# Altium schematic sheet MKXdbV2_ADC0.SchDoc
size A
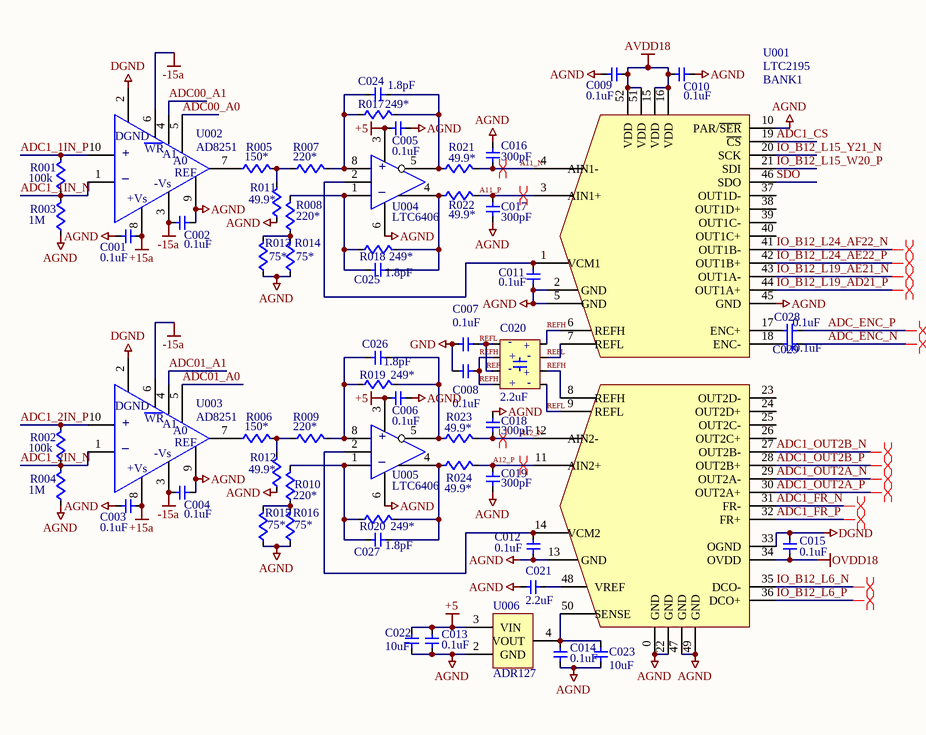
[diagram p0: MKXdbV2_ADC0.SchDoc]

## Parts
C001  0.1uF  [0603w]
C002  0.1uF  [0603w]
C003  0.1uF  [0603w]
C004  0.1uF  [0603w]
C005  0.1uF  [0603w]
C006  0.1uF  [0603w]
C007  0.1uF  [0603w]
C008  0.1uF  [0603w]
C009  0.1uF  [0603w]
C010  0.1uF  [0603w]
C011  0.1uF  [0603w]
C012  0.1uF  [0603w]
C013  0.1uF  [0603w]
C014  0.1uF  [0603w]
C015  0.1uF  [0603w]
C016  300pF  [0603w]
C017  300pF  [0603w]
C018  300pF  [0603w]
C019  300pF  [0603w]
C020  2.2uF  [1206CLL]
C021  2.2uF  [0603w]
C022  10uF  [0603w]
C023  10uF  [0603w]
C024  1.8pF  [0603w]
C025  1.8pF  [0603w]
C026  1.8pF  [0603w]
C027  1.8pF  [0603w]
C028  0.1uF  [1206]
C029  0.1uF  [1206]
R001  100k  [0603w]
R002  100k  [0603w]
R003  1M  [0603w]
R004  1M  [0603w]
R005  150*  [0603w]
R006  150*  [0603w]
R007  220*  [0603w]
R008  220*  [0603w]
R009  220*  [0603w]
R010  220*  [0603w]
R011  49.9*  [0603w]
R012  49.9*  [0603w]
R013  75*  [0603w]
R014  75*  [0603w]
R015  75*  [0603w]
R016  75*  [0603w]
R017  249*  [0603w]
R018  249*  [0603w]
R019  249*  [0603w]
R020  249*  [0603w]
R021  49.9*  [0603w]
R022  49.9*  [0603w]
R023  49.9*  [0603w]
R024  49.9*  [0603w]
U001  LTC2195  [UKG - QFN52]
U002  AD8251  [MSOP10sm]
U003  AD8251  [MSOP10sm]
U004  LTC6406  [MSOP08]
U005  LTC6406  [MSOP08]
U006  ADR127  [TSOT-6]

## Nets
+5: C005.1 C006.1 C013.2 C022.1 U004.3 U005.3 U006.3(VIN)
+15a: C001.1 C003.1 U002.8 U003.8
-15a: C002.1 C004.1 U002.3 U002.6 U003.3 U003.6
AGND: C001.2 C002.2 C003.2 C004.2 C005.2 C006.2 C009.2 C010.2 C011.2 C012.2 C013.1 C014.1 C016.1 C017.2 C018.1 C019.2 C021.2 C022.2 C023.2 R003.1 R004.1 R011.1 R012.1 R013.1 R014.1 R015.1 R016.1 U001.0(GND) U001.2(GND) U001.5(GND) U001.10(PAR/~{SER}) U001.13(GND) U001.22(GND) U001.45(GND) U001.47(GND) U001.49(GND) U002.9 U003.9 U004.6 U005.6 U006.2(GND)
AVDD18: C009.1 C010.1 U001.15(VDD) U001.16(VDD) U001.51(VDD) U001.52(VDD)
DGND: C015.1 U001.33(OGND) U002.2 U003.2
GND: C007.2 C008.2
OVDD18: C015.2 U001.34(OVDD)
A11_N: C016.2 R021.2 U001.4(AIN1-)
A11_P: C017.1 R022.2 U001.3(AIN1+)
A12_N: C018.2 R023.2 U001.12(AIN2-)
A12_P: C019.1 R024.2 U001.11(AIN2+)
ADC00_A0: U002.5
ADC00_A1: U002.4
ADC1_1IN_N: R001.1 R003.2 U002.1
ADC1_1IN_P: R001.2 U002.10
ADC1_2IN_N: R002.1 R004.2 U003.1
ADC1_2IN_P: R002.2 U003.10
ADC01_A0: U003.5
ADC01_A1: U003.4
ADC1_CS: U001.19(~{CS})
ADC1_FR_N: U001.31(FR-)
ADC1_FR_P: U001.32(FR+)
ADC1_OUT2A_N: U001.29(OUT2A-)
ADC1_OUT2A_P: U001.30(OUT2A+)
ADC1_OUT2B_N: U001.27(OUT2B-)
ADC1_OUT2B_P: U001.28(OUT2B+)
ADC_ENC_N: C029.2
ADC_ENC_P: C028.2
IO_B12_L6_N: U001.35(DCO-)
IO_B12_L6_P: U001.36(DCO+)
IO_B12_L15_W20_P: U001.21(SDI)
IO_B12_L15_Y21_N: U001.20(SCK)
IO_B12_L19_AD21_P: U001.44(OUT1A+)
IO_B12_L19_AE21_N: U001.43(OUT1A-)
IO_B12_L24_AE22_P: U001.42(OUT1B+)
IO_B12_L24_AF22_N: U001.41(OUT1B-)
REFH: C008.1 C020.2 C020.4 C020.6 C020.8 U001.6(REFH) U001.8(REFH)
REFL: C007.1 C020.1 C020.3 C020.5 C020.7 U001.7(REFL) U001.9(REFL)
SDO: U001.46(SDO)
NetC011_1: C011.1 U001.1(VCM1) U004.2
NetC012_1: C012.1 U001.14(VCM2) U005.2
NetC014_2: C014.2 C023.1 U001.50(SENSE) U006.4(VOUT)
NetC021_1: C021.1 U001.48(VREF)
NetC024_1: C024.1 R007.2 R017.1 U004.8
NetC024_2: C024.2 R017.2 R021.1 U004.5
NetC025_1: C025.1 R008.2 R018.1 U004.1
NetC025_2: C025.2 R018.2 R022.1 U004.4
NetC026_1: C026.1 R009.2 R019.1 U005.8
NetC026_2: C026.2 R019.2 R023.1 U005.5
NetC027_1: C027.1 R010.2 R020.1 U005.1
NetC027_2: C027.2 R020.2 R024.1 U005.4
NetC028_1: C028.1 U001.17(ENC+)
NetC029_1: C029.1 U001.18(ENC-)
NetR005_1: R005.1 U002.7
NetR005_2: R005.2 R007.1 R011.2
NetR006_1: R006.1 U003.7
NetR006_2: R006.2 R009.1 R012.2
NetR008_1: R008.1 R013.2 R014.2
NetR010_1: R010.1 R015.2 R016.2

Not connected (* = marked no-connect by the designer): U001 23(OUT2D-) 24(OUT2D+) 25(OUT2C-) 26(OUT2C+) 37(OUT1D-) 38(OUT1D+) 39(OUT1C-) 40(OUT1C+); U006 1(NC) 5(NC) 6(NC)

## Layout directives
differential pair: A11_N, A11_P, A12_N, A12_P, ADC1_FR_N, ADC1_FR_P, ADC1_OUT2A_N, ADC1_OUT2A_P, ADC1_OUT2B_N, ADC1_OUT2B_P, ADC_ENC_N, ADC_ENC_P, IO_B12_L6_N, IO_B12_L6_P, IO_B12_L19_AD21_P, IO_B12_L19_AE21_N, IO_B12_L24_AE22_P, IO_B12_L24_AF22_N

## Notes on the sheet
- (near U001) BANK1
- (in symbol AD8139) +; _
- (in symbol AD8251) DGND; WR; +; A1; A0; _; REF; -Vs; +Vs
- (in symbol CAP_SM Interdigitated) +

## Library data of the parts
C001 C002 C003 C004 C006 C007 C008 C009 C010 C011 C012 C013 C014 C015 = CAP_SM_1: capacitor; Manufacturer: Kemet; Manufacturer Part Number: C0603C104K3RACTU; Capacitance: 0.1µF; Temperature Coefficient: X7R; Tolerance: ±10%; Voltage - Rated: 25V; Applications: General Purpose; Category: Capacitors; ComponentLink1Description: http://www.kemet.com/datasheets&C0603C104K3RACTU; ComponentLink1URL: http://www.kemet.com/datasheets&C0603C104K3RACTU; Features: -; Lead Spacing: -; Lead Style: -; Mounting Type: Surface Mount, MLCC; Operating Temperature: -55°C ~ 125°C; Package / Case: 0603 (1608 Metric); Packaging: Cut Tape (CT); Pricing 1: 10=0.075, 100=0.027, 250=0.01952, 500=0.0144, 1000=0.00975 (USD); Ratings: -; RoHS: RoHS Compliant; Size / Dimension: 0.063" L x 0.031" W (1.60mm x 0.80mm); Stock 1: 1185883; Supplier 1: Digi-Key; Supplier Part Number 1: 399-1281-1-ND; Thickness: 0.034" (0.87mm)
C005 = CAP_SM_1: capacitor; Manufacturer: Kemet; Manufacturer Part Number: C0603C104K3RACTU; Capacitance: 0.1µF; Voltage - Rated: 25V; Tolerance: ±10%; Temperature Coefficient: X7R; Supplier 1: Digi-Key; Supplier Part Number 1: 399-1281-1-ND; RoHS: RoHS Compliant; Category: Capacitors; Stock 1: 1185883; Pricing 1: 10=0.075, 100=0.027, 250=0.01952, 500=0.0144, 1000=0.00975 (USD); Mounting Type: Surface Mount, MLCC; Operating Temperature: -55°C ~ 125°C; Applications: General Purpose; Ratings: -; Package / Case: 0603 (1608 Metric); Size / Dimension: 0.063" L x 0.031" W (1.60mm x 0.80mm); Height: -; Thickness: 0.034" (0.87mm); Lead Spacing: -; Features: -; Packaging: Cut Tape (CT); Lead Style: -; ComponentLink1URL: http://www.kemet.com/datasheets&C0603C104K3RACTU; ComponentLink1Description: http://www.kemet.com/datasheets&C0603C104K3RACTU
C016 C017 C018 C019 C024 C025 C026 C027 = CAP_SM_1: capacitor; Supplier 1: Digi-Key
  C016 C017 C018 C019: Supplier Part Number 1: 490-1438-1-ND
  C024 C025 C026 C027: Supplier Part Number 1: 712-1328-1-ND
C020 = CAP_SM Interdigitated: INTERDIGITATED capacitor; Manufacturer: TDK Corporation; Manufacturer Part Number: CLLE1AX7S0G225M/0.95; Capacitance: 2.2µF; Voltage - Rated: 4V; Tolerance: ±20%; Temperature Coefficient: X7S; Supplier 1: Digi-Key; Supplier Part Number 1: 445-3406-1-ND; RoHS: RoHS Compliant; Category: Capacitors; Stock 1: 11249; Pricing 1: 1=0.68, 10=0.54, 100=0.325, 250=0.24376, 500=0.208, 1000=0.1625 (USD); Mounting Type: Surface Mount, MLCC; Operating Temperature: -55°C ~ 125°C; Applications: General Purpose; Ratings: -; Package / Case: 0805 (2012 Metric); Size / Dimension: 0.079" L x 0.049" W (2.00mm x 1.25mm); Height: -; Thickness: 0.037" (0.95mm); Lead Spacing: -; Features: Low ESL (Multi-Terminal); Packaging: Cut Tape (CT); Lead Style: -; ComponentLink1URL: http://www.tdk.com/pdf/uli_A11.pdf; ComponentLink1Description: http://www.tdk.com/pdf/uli_A11.pdf
C021 = CAP_SM_1: capacitor; Manufacturer: AVX Corporation; Manufacturer Part Number: 06036C225KAT2A; Capacitance: 2.2µF; Voltage - Rated: 6.3V; Tolerance: ±10%; Temperature Coefficient: X7R; Supplier 1: Digi-Key; Supplier Part Number 1: 478-5316-1-ND; RoHS: RoHS Compliant; Category: Capacitors; Stock 1: 284343; Pricing 1: 10=0.209, 100=0.1235, 500=0.07126, 1000=0.0494 (USD); Mounting Type: Surface Mount, MLCC; Operating Temperature: -55°C ~ 125°C; Applications: General Purpose; Ratings: -; Package / Case: 0603 (1608 Metric); Size / Dimension: 0.063" L x 0.032" W (1.60mm x 0.81mm); Height: -; Thickness: 0.035" (0.90mm); Lead Spacing: -; Features: -; Packaging: Cut Tape (CT); Lead Style: -; ComponentLink1URL: http://www.avx.com/docs/Catalogs/cx7r.pdf; ComponentLink1Description: http://www.avx.com/docs/Catalogs/cx7r.pdf
C022 C023 = CAP_SM_1: capacitor; Manufacturer: Murata Electronics North America; Manufacturer Part Number: GRM188R60J106ME47D; Capacitance: 10µF; Voltage - Rated: 6.3V; Tolerance: ±20%; Temperature Coefficient: X5R; Supplier 1: Digi-Key; Supplier Part Number 1: 490-3896-1-ND; RoHS: RoHS Compliant; Category: Capacitors; Stock 1: 1274844; Pricing 1: 1=0.47, 10=0.369, 50=0.2428, 100=0.1926, 250=0.14236, 500=0.11056, 1000=0.0871 (USD); Mounting Type: Surface Mount, MLCC; Operating Temperature: -55°C ~ 85°C; Applications: General Purpose; Ratings: -; Package / Case: 0603 (1608 Metric); Size / Dimension: 0.063" L x 0.031" W (1.60mm x 0.80mm); Height: -; Thickness: 0.035" (0.90mm); Lead Spacing: -; Features: -; Packaging: Cut Tape (CT); Lead Style: -; ComponentLink1URL: http://search.murata.co.jp/Ceramy/image/img/PDF/ENG/GRM188R60J106ME47.pdf; ComponentLink1Description: http://search.murata.co.jp/Ceramy/image/img/PDF/ENG/GRM188R60J106ME47.pdf
C028 C029 = CAP_SM_1: capacitor; Manufacturer: Murata Electronics North America; Manufacturer Part Number: GRM31C5C1E104JA01L; Capacitance: 0.1µF; Voltage - Rated: 25V; Tolerance: ±5%; Temperature Coefficient: C0G, NP0; Supplier 1: Digi-Key; Supplier Part Number 1: 490-1767-1-ND; RoHS: RoHS Compliant; Category: Capacitors; Stock 1: 374793; Pricing 1: 1=0.57, 10=0.48, 50=0.3436, 100=0.3007, 250=0.23628, 500=0.2148, 1000=0.17184 (USD); Mounting Type: Surface Mount, MLCC; Operating Temperature: -55°C ~ 125°C; Applications: General Purpose; Ratings: -; Package / Case: 1206 (3216 Metric); Size / Dimension: 0.126" L x 0.063" W (3.20mm x 1.60mm); Height: -; Thickness: 0.071" (1.80mm); Lead Spacing: -; Features: -; Packaging: Cut Tape (CT); Lead Style: -; ComponentLink1URL: http://search.murata.co.jp/Ceramy/image/img/PDF/ENG/GRM31C5C1E104JA01.pdf; ComponentLink1Description: http://search.murata.co.jp/Ceramy/image/img/PDF/ENG/GRM31C5C1E104JA01.pdf
R001 R002 = RES_SM: resistor; Manufacturer: Yageo; Manufacturer Part Number: RC0603FR-07100KL; Power (Watts): 0.1W, 1/10W; Temperature Coefficient: ±100ppm/°C; Tolerance: ±1%; Supplier 1: Digi-Key; Supplier Part Number 1: 311-100KHRCT-ND; RoHS: RoHS Compliant; Category: Resistors; Stock 1: 3397757; Pricing 1: 10=0.014, 50=0.0104, 100=0.0079, 250=0.00584, 500=0.00432, 1000=0.00288 (USD); Resistance (Ohms): 100K; Composition: Thick Film; Features: -; Size / Dimension: 0.063" L x 0.031" W (1.60mm x 0.80mm); Height: 0.018" (0.45mm); Number of Terminations: 2; Packaging: Cut Tape (CT); Package / Case: 0603 (1608 Metric); ComponentLink1URL: http://www.yageo.com/documents/recent/PYu-RC0603_51_RoHS_L_4.pdf; ComponentLink1Description: http://www.yageo.com/documents/recent/PYu-RC0603_51_RoHS_L_4.pdf
R003 R004 = RES_SM: resistor; Manufacturer: Yageo; Manufacturer Part Number: RC0603FR-071ML; Power (Watts): 0.1W, 1/10W; Temperature Coefficient: ±100ppm/°C; Tolerance: ±1%; Supplier 1: Digi-Key; Supplier Part Number 1: 311-1.00MHRCT-ND; RoHS: RoHS Compliant; Category: Resistors; Stock 1: 1849601; Pricing 1: 10=0.014, 50=0.0104, 100=0.0079, 250=0.00584, 500=0.00432, 1000=0.00288 (USD); Resistance (Ohms): 1M; Composition: Thick Film; Features: -; Size / Dimension: 0.063" L x 0.031" W (1.60mm x 0.80mm); Height: 0.018" (0.45mm); Number of Terminations: 2; Packaging: Cut Tape (CT); Package / Case: 0603 (1608 Metric); ComponentLink1URL: http://www.yageo.com/documents/recent/PYu-RC0603_51_RoHS_L_4.pdf; ComponentLink1Description: http://www.yageo.com/documents/recent/PYu-RC0603_51_RoHS_L_4.pdf
R005 R006 R007 R008 R009 R010 R017 R018 R019 R020 = RES_SM: resistor; Supplier 1: Digi-Key
  R005 R006: Supplier Part Number 1: RNCS0603BKE150RCT-ND
  R007 R008 R009 R010: Supplier Part Number 1: RG16P220BCT-ND
  R017 R018 R019 R020: Supplier Part Number 1: RNCS0603BKE249RCT-ND
R011 R012 R021 R022 R023 R024 = RES_SM: resistor; Manufacturer: Stackpole Electronics Inc; Manufacturer Part Number: RNCS0603BKE49R9; Resistance (Ohms): 49.9; Power (Watts): 0.063W, 1/16W; Temperature Coefficient: ±25ppm/°C; Tolerance: ±0.1%; Supplier 1: Digi-Key; Supplier Part Number 1: RNCS0603BKE49R9CT-ND; RoHS: RoHS Compliant; Category: Resistors; Stock 1: 13782; Pricing 1: 1=0.7, 10=0.475, 50=0.2876, 100=0.2375, 250=0.18752, 500=0.16 (USD); Composition: Thin Film; Features: Anti-Corrosive, Moisture Resistant; Size / Dimension: 0.061" L x 0.031" W (1.55mm x 0.80mm); Height: 0.018" (0.45mm); Number of Terminations: 2; Packaging: Cut Tape (CT); Package / Case: 0603 (1608 Metric); ComponentLink1URL: http://www.seielect.com/Catalog/SEI-rncs.pdf; ComponentLink1Description: http://www.seielect.com/Catalog/SEI-rncs.pdf
R013 R014 R015 R016 = RES_SM: resistor; Manufacturer: Stackpole Electronics Inc; Manufacturer Part Number: RNCS0603BKE75R0; Resistance (Ohms): 75; Power (Watts): 0.063W, 1/16W; Temperature Coefficient: ±25ppm/°C; Tolerance: ±0.1%; Supplier 1: Digi-Key; Supplier Part Number 1: RNCS0603BKE75R0CT-ND; RoHS: RoHS Compliant; Category: Resistors; Stock 1: 2583; Pricing 1: 1=0.7, 10=0.475, 50=0.2876, 100=0.2375, 250=0.18752, 500=0.16 (USD); Composition: Thin Film; Features: Anti-Corrosive, Moisture Resistant; Size / Dimension: 0.061" L x 0.031" W (1.55mm x 0.80mm); Height: 0.018" (0.45mm); Number of Terminations: 2; Packaging: Cut Tape (CT); Package / Case: 0603 (1608 Metric); ComponentLink1URL: http://www.seielect.com/Catalog/SEI-rncs.pdf; ComponentLink1Description: http://www.seielect.com/Catalog/SEI-rncs.pdf
U001 = LTC2195: 16 bit, low power, dual ADC; Supplier 1: Digi-Key; Supplier Part Number 1: LTC2195CUKG#PBF-ND
U002 = AD8251: Programmable Gain Instumentation Amp; Supplier 1: Digi-Key; Supplier Part Number 1: AD8251ARMZ-ND
U003 = AD8251: IC AMP INST ICMOS LDRIFT 10MSOP; Supplier 1: Digi-Key; Supplier Part Number 1: AD8251ARMZ-ND
U004 U005 = AD8139: Differential ADC Driver; Supplier 1: Digi-Key; Supplier Part Number 1: LTC6406CMS8E#PBF-ND
U006 = ADR12x: Voltage Reference; Manufacturer: Analog Devices Inc; Manufacturer Part Number: ADR127AUJZ-REEL7; Reference Type: Series, Precision; Voltage - Output: 1.25V; Tolerance: ±0.24%; Temperature Coefficient: 25ppm/°C; Voltage - Input: 2.7 V ~ 18 V; Number of Channels: 1; Current - Quiescent: 95µA; Current - Output: 5mA; Supplier 1: Digi-Key; Supplier Part Number 1: ADR127AUJZ-REEL7CT-ND; RoHS: RoHS Compliant; Category: Integrated Circuits (ICs); Stock 1: 17098; Pricing 1: 1=3.22, 25=2.484, 100=2.254, 250=2.024, 500=1.748 (USD); Current - Cathode: -; Operating Temperature: -40°C ~ 125°C; Mounting Type: Surface Mount; Package / Case: TSOT-23-6, TSOT-6; Supplier Device Package: TSOT-6; Packaging: Cut Tape (CT); ComponentLink1URL: http://www.analog.com/static/imported-files/Data_Sheets/ADR121_125_127.pdf; ComponentLink1Description: http://www.analog.com/static/imported-files/Data_Sheets/ADR121_125_127.pdf